# Altium schematic sheet Interface.SchDoc
size A4
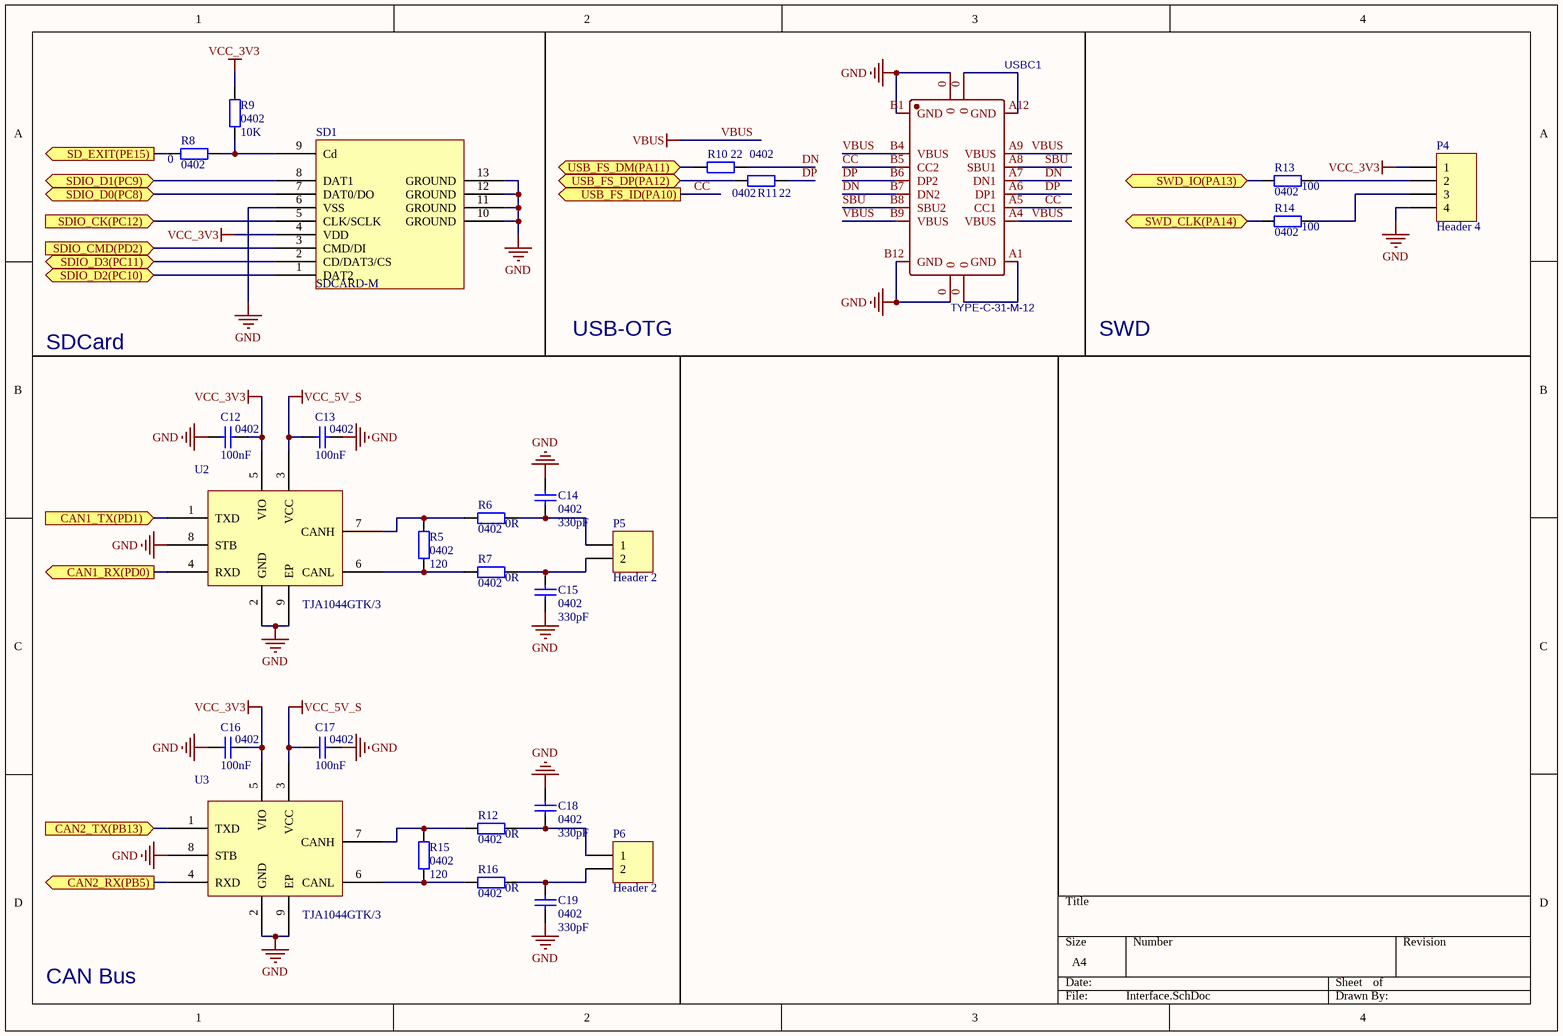
[diagram p0: Interface.SchDoc]

## Parts
C12  0402  value 100nF  [C 0402_L]
C13  0402  value 100nF  [C 0402_L]
C14  0402  value 330pF  [C 0402_L]
C15  0402  value 330pF  [C 0402_L]
C16  0402  value 100nF  [C 0402_L]
C17  0402  value 100nF  [C 0402_L]
C18  0402  value 330pF  [C 0402_L]
C19  0402  value 330pF  [C 0402_L]
P4  Header 4  [HDR2.54-LI-4P]
P5  Header 2  [HDR2.54-LI-2P]
P6  Header 2  [HDR2.54-LI-2P]
R5  0402  value 120  [R 0402_L]
R6  0402  value 0R  [R 0402_L]
R7  0402  value 0R  [R 0402_L]
R8  0402  value 0  [R 0402_L]
R9  0402  value 10K  [R 0402_L]
R10  0402  value 22  [R 0402_L]
R11  0402  value 22  [R 0402_L]
R12  0402  value 0R  [R 0402_L]
R13  0402  value 100  [R 0402_L]
R14  0402  value 100  [R 0402_L]
R15  0402  value 120  [R 0402_L]
R16  0402  value 0R  [R 0402_L]
SD1  SDCARD-M  [SDCARD-M]
U2  TJA1044GTK/3  [HVSON8]
U3  TJA1044GTK/3  [HVSON8]
USBC1  TYPE-C-31-M-12  [USB-TYPE-C_16PIN-MALE-TYPE-C-31-M-12]

## Ports
CAN1_RX(PD0) (out), CAN1_TX(PD1) (in), CAN2_RX(PB5) (out), CAN2_TX(PB13) (in), SD_EXIT(PE15) (out), SDIO_CK(PC12) (in), SDIO_CMD(PD2) (in), SDIO_D0(PC8) (bidir), SDIO_D1(PC9) (bidir), SDIO_D2(PC10) (bidir), SDIO_D3(PC11) (bidir), SWD_CLK(PA14) (bidir), SWD_IO(PA13) (bidir), USB_FS_DM(PA11) (bidir), USB_FS_DP(PA12) (bidir), USB_FS_ID(PA10) (out)

## Nets
GND: C12.1 C13.2 C14.2 C15.1 C16.1 C17.2 C18.2 C19.1 P4.4 SD1.6(VSS) SD1.10(GROUND) SD1.11(GROUND) SD1.12(GROUND) SD1.13(GROUND) U2.2(GND) U2.8(STB) U2.9(EP) U3.2(GND) U3.8(STB) U3.9(EP) USBC1.0 USBC1.B1(GND) USBC1.B12(GND)
VBUS: USBC1.A4(VBUS) USBC1.A9(VBUS) USBC1.B4(VBUS) USBC1.B9(VBUS)
VCC_3V3: C12.2 C16.2 P4.1 R9.2 SD1.4(VDD) U2.5(VIO) U3.5(VIO)
VCC_5V_S: C13.1 C17.1 U2.3(VCC) U3.3(VCC)
CAN1_RX(PD0): U2.4(RXD) ; port CAN1_RX(PD0)
CAN1_TX(PD1): U2.1(TXD) ; port CAN1_TX(PD1)
CAN2_RX(PB5): U3.4(RXD) ; port CAN2_RX(PB5)
CAN2_TX(PB13): U3.1(TXD) ; port CAN2_TX(PB13)
CC: USBC1.A5(CC1) USBC1.B5(CC2) ; port USB_FS_ID(PA10)
DN: R10.2 USBC1.A7(DN1) USBC1.B7(DN2)
DP: R11.2 USBC1.A6(DP1) USBC1.B6(DP2)
SBU: USBC1.A8(SBU1) USBC1.B8(SBU2)
SD_EXIT(PE15): R8.1 ; port SD_EXIT(PE15)
SDIO_CK(PC12): SD1.5(CLK/SCLK) ; port SDIO_CK(PC12)
SDIO_CMD(PD2): SD1.3(CMD/DI) ; port SDIO_CMD(PD2)
SDIO_D0(PC8): SD1.7(DAT0/DO) ; port SDIO_D0(PC8)
SDIO_D1(PC9): SD1.8(DAT1) ; port SDIO_D1(PC9)
SDIO_D2(PC10): SD1.1(DAT2) ; port SDIO_D2(PC10)
SDIO_D3(PC11): SD1.2(CD/DAT3/CS) ; port SDIO_D3(PC11)
SWD_CLK(PA14): R14.1 ; port SWD_CLK(PA14)
SWD_IO(PA13): R13.1 ; port SWD_IO(PA13)
USB_FS_DM(PA11): R10.1 ; port USB_FS_DM(PA11)
USB_FS_DP(PA12): R11.1 ; port USB_FS_DP(PA12)
NetC14_1: C14.1 P5.1 R6.1
NetC15_2: C15.2 P5.2 R7.1
NetC18_1: C18.1 P6.1 R12.1
NetC19_2: C19.2 P6.2 R16.1
NetP4_2: P4.2 R13.2
NetP4_3: P4.3 R14.2
NetR5_1: R5.1 R7.2 U2.6(CANL)
NetR5_2: R5.2 R6.2 U2.7(CANH)
NetR8_2: R8.2 R9.1 SD1.9(Cd)
NetR12_2: R12.2 R15.2 U3.7(CANH)
NetR15_1: R15.1 R16.2 U3.6(CANL)
NetUSBC1_0: USBC1.0 USBC1.A12(GND)
NetUSBC1_0: USBC1.0 USBC1.A1(GND)  [a separate net that carries the same name]

## Notes on the sheet
- SDCard
- USB-OTG
- SWD
- CAN Bus

## Library data of the parts
C12-C19 = CAP
P4 = Header 4: Header, 4-Pin; LatestRevisionDate: 17-Jul-2002; LatestRevisionNote: Re-released for DXP Platform.; Publisher: Altium Limited
P5 P6 = Header 2: Header, 2-Pin; LatestRevisionDate: 17-Jul-2002; LatestRevisionNote: Re-released for DXP Platform.; Publisher: Altium Limited
R5-R16 = RES2: Resistor; Published: 8-Jun-2000; LatestRevisionDate: 17-Jul-2002; LatestRevisionNote: Re-released for DXP Platform.; PackageReference: AXIAL-0.3; Publisher: Altium Limited; PackageDescription: Axial Device, Thru-Hole; 2 Leads; 0.3 in Pin Spacing
SD1 = SDCARD-M: TF卡槽